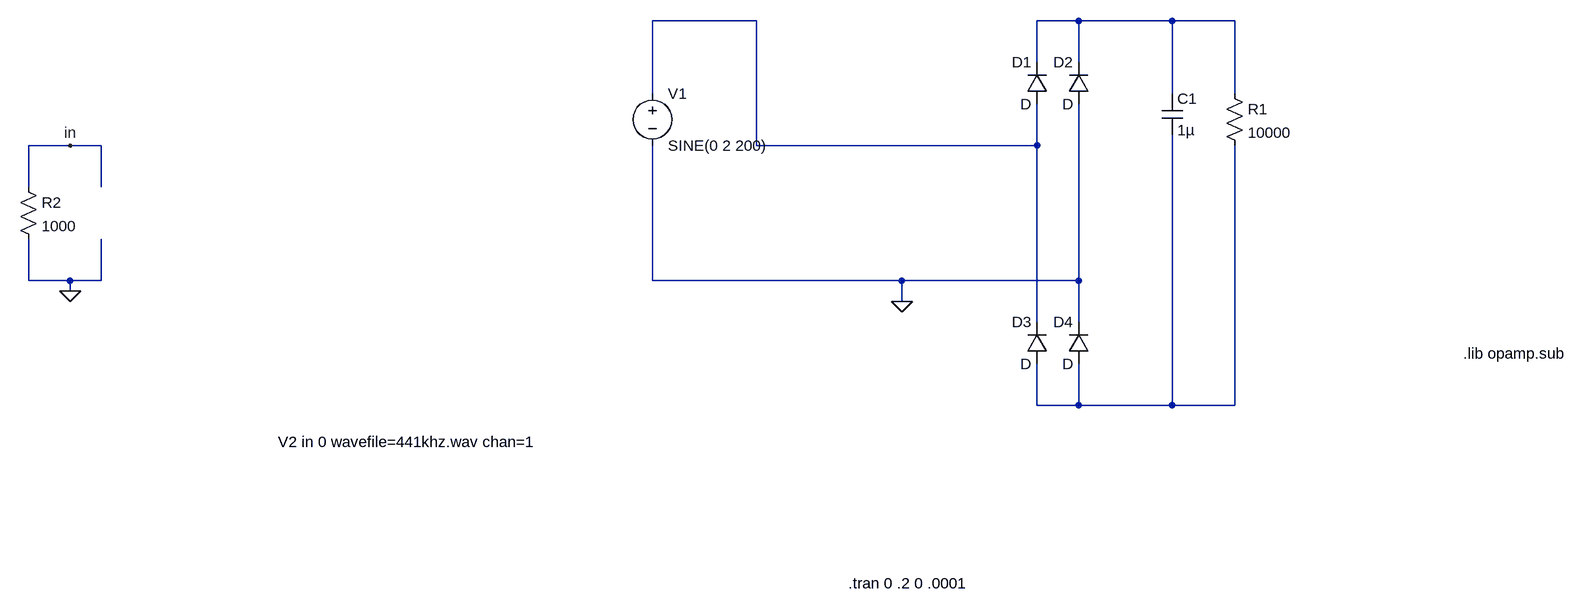
[diagram p0: schematic eq_sim_complete.asc]
eq_sim_complete.asc, the LTspice schematic file:
Version 4
SHEET 1 880 708
WIRE -672 -176 -832 -176
WIRE -176 -176 -240 -176
WIRE -32 -176 -176 -176
WIRE 64 -176 -32 -176
WIRE -240 -112 -240 -176
WIRE -176 -112 -176 -176
WIRE -832 -64 -832 -176
WIRE -32 -64 -32 -176
WIRE 64 -64 64 -176
WIRE -1728 16 -1792 16
WIRE -1680 16 -1728 16
WIRE -672 16 -672 -176
WIRE -240 16 -240 -48
WIRE -240 16 -672 16
WIRE -1792 80 -1792 16
WIRE -1680 80 -1680 16
WIRE -1792 224 -1792 160
WIRE -1728 224 -1792 224
WIRE -1680 224 -1680 160
WIRE -1680 224 -1728 224
WIRE -832 224 -832 16
WIRE -448 224 -832 224
WIRE -176 224 -176 -48
WIRE -176 224 -448 224
WIRE -1728 240 -1728 224
WIRE -448 256 -448 224
WIRE -240 288 -240 16
WIRE -176 288 -176 224
WIRE -240 416 -240 352
WIRE -176 416 -176 352
WIRE -176 416 -240 416
WIRE -32 416 -32 0
WIRE -32 416 -176 416
WIRE 64 416 64 16
WIRE 64 416 -32 416
FLAG -448 256 0
FLAG -1728 240 0
FLAG -1728 16 in
SYMBOL voltage -832 -80 R0
WINDOW 123 24 124 Left 2
WINDOW 39 0 0 Left 2
SYMATTR InstName V1
SYMATTR Value SINE(0 2 200)
SYMBOL diode -224 -48 R180
WINDOW 0 24 64 Left 2
WINDOW 3 24 0 Left 2
SYMATTR InstName D1
SYMBOL diode -160 -48 R180
WINDOW 0 24 64 Left 2
WINDOW 3 24 0 Left 2
SYMATTR InstName D2
SYMBOL diode -224 352 R180
WINDOW 0 24 64 Left 2
WINDOW 3 24 0 Left 2
SYMATTR InstName D3
SYMBOL diode -160 352 R180
WINDOW 0 24 64 Left 2
WINDOW 3 24 0 Left 2
SYMATTR InstName D4
SYMBOL cap -48 -64 R0
SYMATTR InstName C1
SYMATTR Value 1µ
SYMBOL res 48 -80 R0
SYMATTR InstName R1
SYMATTR Value 10000
SYMBOL res -1808 64 R0
SYMATTR InstName R2
SYMATTR Value 1000
TEXT 416 336 Left 2 !.lib opamp.sub
TEXT -530 690 Left 2 !.tran 0 .2 0 .0001
TEXT -1408 472 Left 2 !V2 in 0 wavefile=441khz.wav chan=1

The netlist it stands for:
* eq_sim_complete.asc
V1 N001 0 SINE(0 2 200)
D1 N001 N002 D
D2 0 N002 D
D3 N003 N001 D
D4 N003 0 D
C1 N002 N003 1µ
R1 N002 N003 10000
R2 in 0 1000
.model D D
.lib standard.dio
.lib opamp.sub
.tran 0 .2 0 .0001
V2 in 0 wavefile=441khz.wav chan=1
.backanno
.end